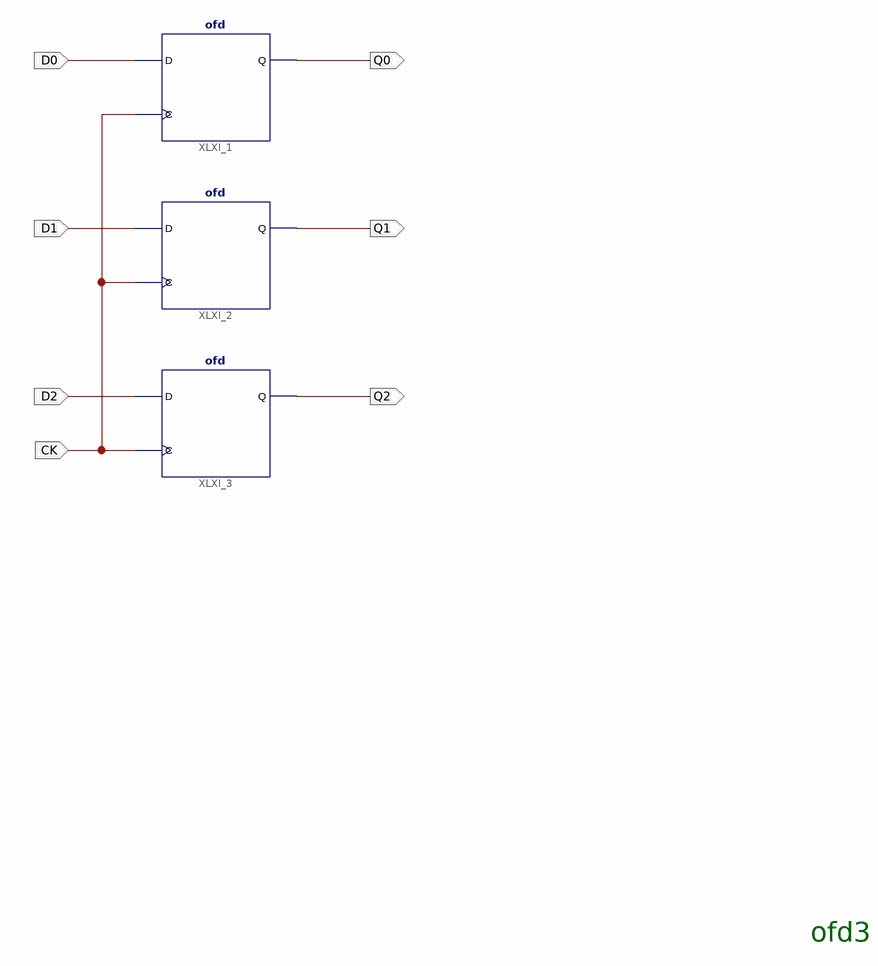
[diagram p0: schematic sheet 1]
// Xilinx ISE schematic ofd3.sch (virtex2p) as structural Verilog: 3 symbols, 7 ports
module ofd3 (
  input  D0,
  input  D1,
  input  D2,
  input  CK,
  output Q2,
  output Q1,
  output Q0
);

  ofd XLXI_1 (.C(CK), .D(D0), .Q(Q0));
  ofd XLXI_2 (.C(CK), .D(D1), .Q(Q1));
  ofd XLXI_3 (.C(CK), .D(D2), .Q(Q2));

  // Notes on the sheet:
  //   ofd3
endmodule
